# Altium schematic sheet PDM-S08-V00-PDMCConnector.SchDoc: PDMC Connector
size A3; DrawnBy: Zoe Goodward; Organization: QUT Motorsport; Address1: O-120, Gardens Point; Address2: 2 George Street; Address3: Brisbane, QLD 4000; Address4: Australia; DocumentNumber: 8; Revision: 01; SheetNumber: 8; SheetTotal: 9; Version: 01; Project: Power Distribution Module; PageSetup: Record=PageOptions|CenterHorizontal=True|CenterVertical=True|PrintScale=0.97|XCorrection=1.00|YCorrection=1.00|PrintKind=0|BorderSize=5000000|LeftOffset=0|BottomOffset=0|Orientation=2|PaperLength=1000|PaperWidth=1000|Scale=100|PaperSource=7|PrintQuality=-4|MediaType=1|DitherType=10|PaperKind=A4|PrintScaleMode=1
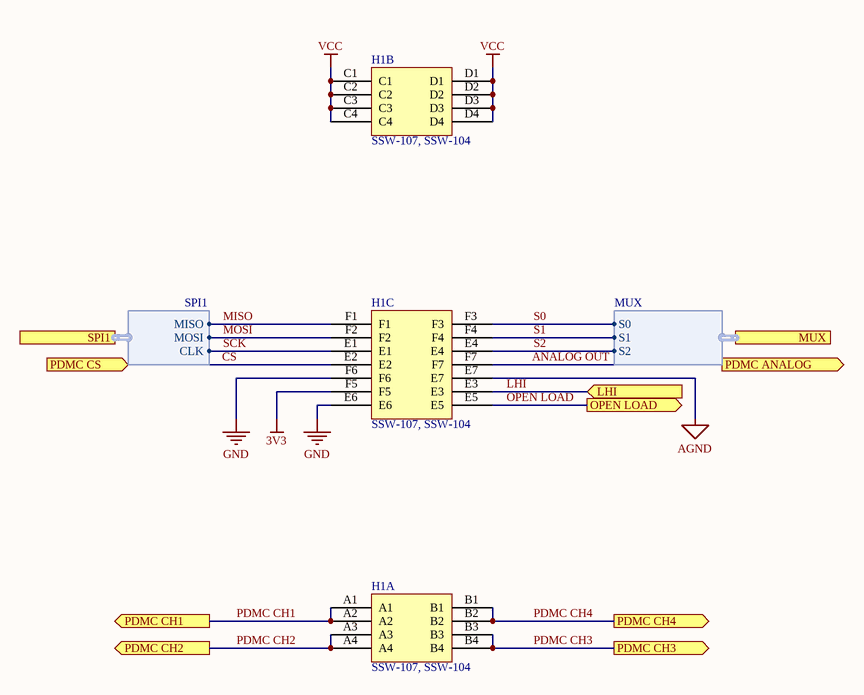
[diagram p0: PDM-S08-V00-PDMCConnector.SchDoc]

## Parts
H1  SSW-107, SSW-104  [SSW-107, SSW-104]  (parts A,B,C of 3)

## Ports
LHI (in), MUX (harness MUX), OPEN LOAD (out), PDMC ANALOG (out), PDMC CH1 (out), PDMC CH2 (out), PDMC CH3 (out), PDMC CH4 (out), PDMC CS (in), SPI1 (harness SPI1)

## Harnesses
MUX: S0, S1, S2
SPI1: MOSI, MISO, CLK

## Nets
3V3: H1.F5
AGND: H1.E7
GND: H1.E6 H1.F6
VCC: H1.C1 H1.C2 H1.C3 H1.C4 H1.D1 H1.D2 H1.D3 H1.D4
ANALOG OUT: H1.F7 ; port PDMC ANALOG
CS: H1.E2 ; port PDMC CS
LHI: H1.E3 ; port LHI
MISO: H1.F1 ; port SPI1.MISO
MOSI: H1.F2 ; port SPI1.MOSI
OPEN LOAD: H1.E5 ; port OPEN LOAD
PDMC CH1: H1.A1 H1.A2 ; port PDMC CH1
PDMC CH2: H1.A3 H1.A4 ; port PDMC CH2
PDMC CH3: H1.B3 H1.B4 ; port PDMC CH3
PDMC CH4: H1.B1 H1.B2 ; port PDMC CH4
S0: H1.F3 ; port MUX.S0
S1: H1.F4 ; port MUX.S1
S2: H1.E4 ; port MUX.S2
SCK: H1.E1 ; port SPI1.CLK

## Notes on the sheet
- Revision History:
- Sheet Title:
- Rev
- Date
- Description
- Project:
- Size:
- Drawn By:
- A3
- Number:
- Revision:
- Sheet
- Version:
- of
- QUT Motorsport
- O-120, Gardens Point
- 2 George Street
- Brisbane, QLD 4000
- Australia
- Print Date:
- Print Time:
- File Name:

## Library data of the parts
H1 = SSW-107, SSW-104: CONN RCPT 8POS, 14POS 0.1 TIN PCB; ComponentLink1Description: Datasheet; ComponentLink1URL: http://suddendocs.samtec.com/catalog_english/ssw_th.pdf; ComponentLink2Description: Digikey; ComponentLink2URL: https://www.digikey.com.au/product-detail/en/samtec-inc/SSW-104-01-F-D/SAM10017-ND/6678754; ComponentLink3Description: Digikey; ComponentLink3URL: https://www.digikey.com.au/product-detail/en/samtec-inc/SSW-107-01-F-D/SAM9144-ND/6613824